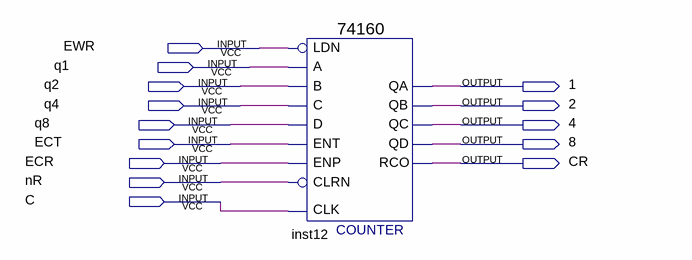
[diagram p0: schematic sheet]
// Quartus schematic kp15533IE9.bdf as structural Verilog: 1 symbols, 14 pins
module kp15533IE9 (
  input  EWR,
  input  q1,
  input  q2,
  input  q4,
  input  q8,
  input  ECT,
  input  ECR,
  input  nR,
  input  C,
  output \1 ,
  output \2 ,
  output \4 ,
  output \8 ,
  output CR
);

  \74160  inst12 (
    .CLK(C), .ENT(ECT), .A(q1), .B(q2), .C(q4), .D(q8), .LDN(EWR), .ENP(ECR), .CLRN(nR), .QD(\8 ), .QA(\1 ),
    .QB(\2 ), .QC(\4 ), .RCO(CR));
endmodule
